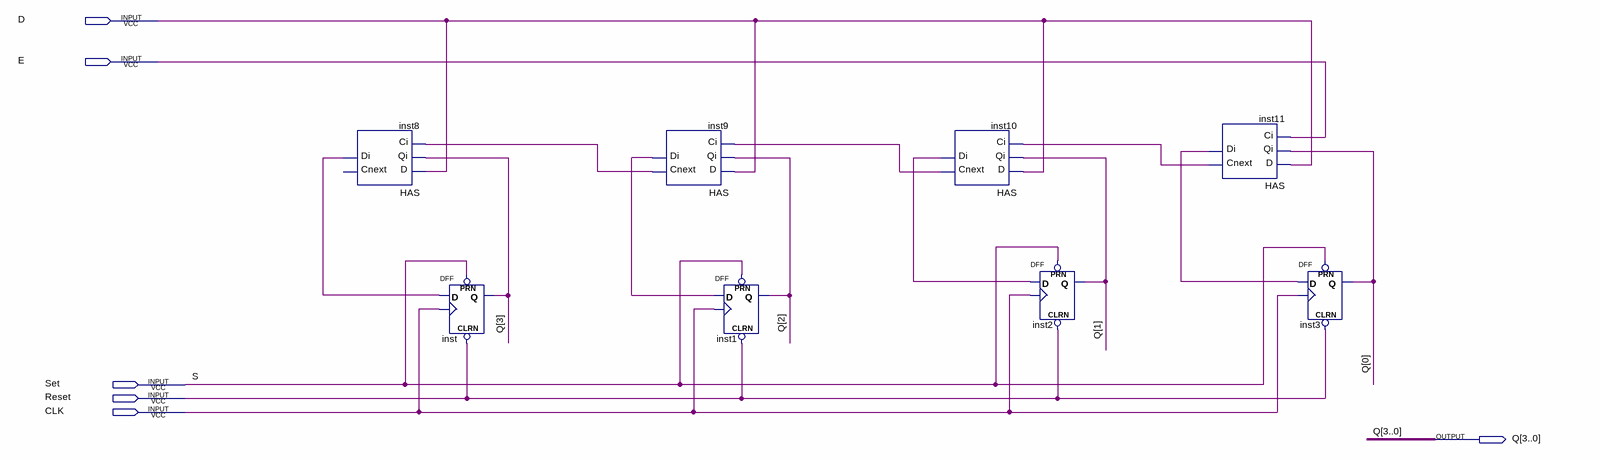
[diagram p0: schematic sheet]
// Quartus schematic CounterUp_Down.bdf as structural Verilog: 8 symbols, 6 pins
module CounterUp_Down (
  input  D,
  input  E,
  input  Set,
  input  Reset,
  input  CLK,
  output [3:0] Q
);

  wire inst8_di, inst9_cnext, inst9_di, inst10_cnext, inst10_di, inst11_cnext, inst11_di;

  HAS inst8 (.D(D), .Qi(Q[3]), .Ci(inst9_cnext), .Di(inst8_di));  // open: Cnext
  DFF inst (.CLRN(Reset), .CLK(CLK), .D(inst8_di), .PRN(Set), .Q(Q[3]));
  HAS inst9 (.D(D), .Qi(Q[2]), .Ci(inst10_cnext), .Cnext(inst9_cnext), .Di(inst9_di));
  DFF inst1 (.CLRN(Reset), .CLK(CLK), .D(inst9_di), .PRN(Set), .Q(Q[2]));
  HAS inst10 (.D(D), .Qi(Q[1]), .Ci(inst11_cnext), .Cnext(inst10_cnext), .Di(inst10_di));
  DFF inst2 (.CLRN(Reset), .CLK(CLK), .D(inst10_di), .PRN(Set), .Q(Q[1]));
  HAS inst11 (.D(D), .Qi(Q[0]), .Ci(E), .Cnext(inst11_cnext), .Di(inst11_di));
  DFF inst3 (.CLRN(Reset), .CLK(CLK), .D(inst11_di), .PRN(Set), .Q(Q[0]));

  // Other names for the same wires on the sheet: S = Set
endmodule
